# Altium schematic sheet test.SchDoc
size A4; SheetNumber: 1; SheetTotal: 1
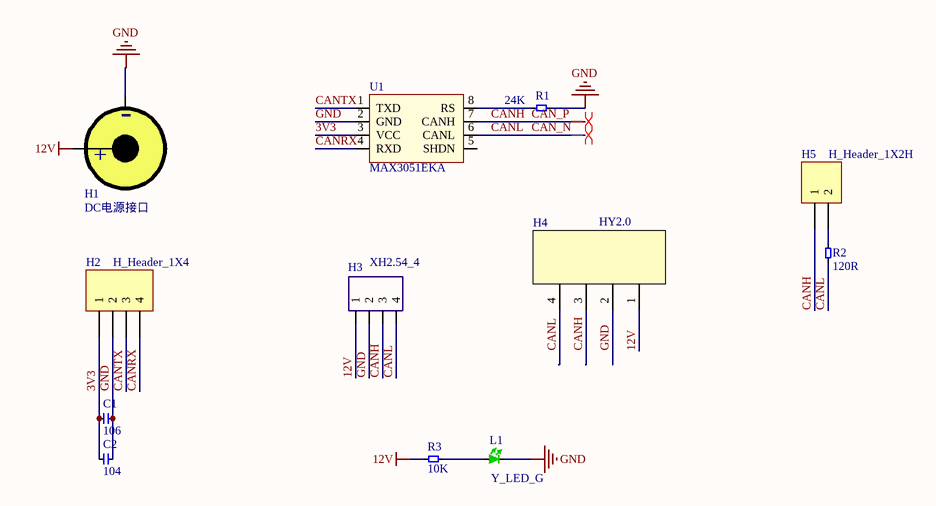
[diagram p0: test.SchDoc]

## Parts
C1  106  [C_0603]
C2  104  [C_0603]
H1  DC电源接口  [DC005-插件]
H2  H_Header_1X4  [H_Header_1X4]
H3  XH2.54_4  [H_XH2.54_4]
H4  HY2.0  [HY2.0_4P_插直 - duplicate]
H5  H_Header_1X2H  [H_Header_1X2]
L1  Y_LED_G  [Y_LED_0603_G]
R1  24K  [R_0603]
R2  120R  [R_0603]
R3  10K  [R_0603]
U1  MAX3051EKA  [SOT23-8]

## Nets
12V: H1.2 H3.1 H4.1 R3.1
GND: C1.2 C2.2 H1.1 H2.2 H3.2 H4.2 L1.2 R1.1 U1.2(GND)
3V3: C1.1 C2.1 H2.1 U1.3(VCC)
CAN_N: H3.4 H4.4 R2.1 U1.6(CANL)  [also labelled CANL]
CAN_P: H3.3 H4.3 H5.1 U1.7(CANH)  [also labelled CANH]
CANRX: H2.4 U1.4(RXD)
CANTX: H2.3 U1.1(TXD)
NetH5_2: H5.2 R2.2
NetL1_1: L1.1 R3.2
NetR1_2: R1.2 U1.8(RS)

Not connected (* = marked no-connect by the designer): U1 5(SHDN)

## Layout directives
differential pair: CAN_N, CAN_P

## Notes on the sheet
- (in symbol DC电源接口) -; +

## Library data of the parts
C1 C2 = C_无极贴片: 无极性贴片电容
H2 = H_Header_1X4: 单排4针排针; LatestRevisionDate: 17-Jul-2002; LatestRevisionNote: Re-released for DXP Platform.; Publisher: Altium Limited
H3 = H_XH2.54_4: 4脚小白头; LatestRevisionDate: 17-Jul-2002; LatestRevisionNote: Re-released for DXP Platform.; Publisher: Altium Limited
H4 = HY2.0_4P
H5 = H_Header_1X2H: 单排2针排母; LatestRevisionDate: 17-Jul-2002; LatestRevisionNote: Re-released for DXP Platform.; Publisher: Altium Limited
L1 = Y_LED_G: 绿色LED
R1-R3 = R_贴片: 贴片电阻
U1 = MAX3051EKA: CAN-1Mbps